# EAGLE design untitled (EAGLE 6.3)
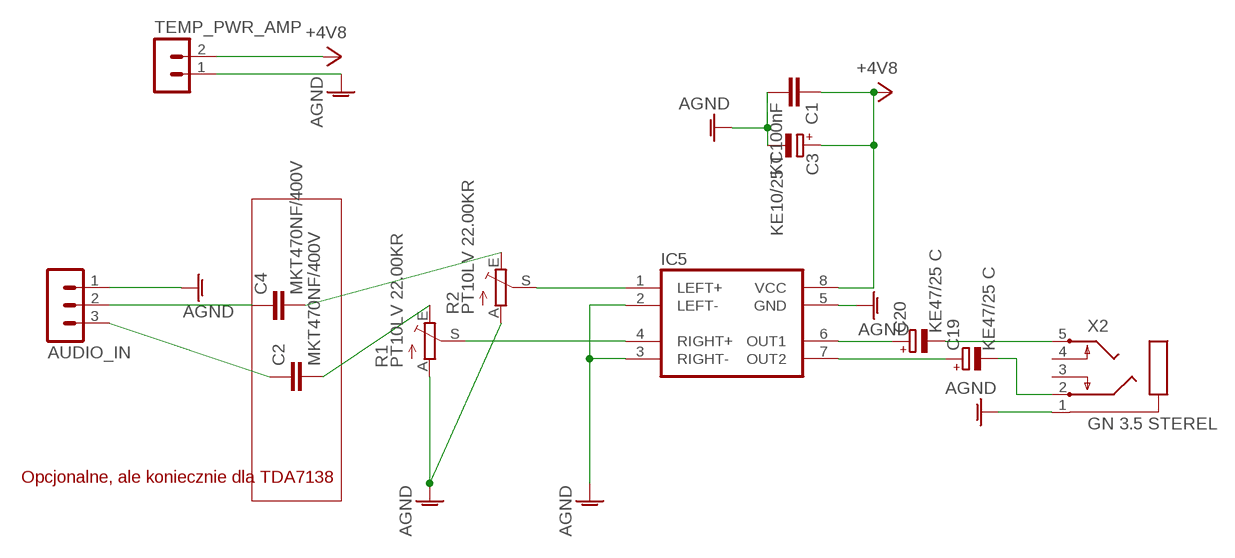
[diagram p0: schematic, sheet 1]

## Parts
AUDIO_IN  MA03-1  [MA03-1]
C1  KC100nF  C-EU025-025X050  [C025-025X050]
C2  MKT470NF/400V  C-EU150-091X182  [C150-091X182]
C3  KE10/25 T  CPOL-EUTT2D6  [TT2D6]
C4  MKT470NF/400V  C-EU150-091X182  [C150-091X182]
C19  KE47/25 C  CPOL-EUD  [PANASONIC_D]
C20  KE47/25 C  CPOL-EUD  [PANASONIC_D]
IC5  TDA7050  [DIL08]
R1  PT10LV 22.00KR  TRIM_EU-CA9V  [CA9V]
R2  PT10LV 22.00KR  TRIM_EU-CA9V  [CA9V]
TEMP_PWR_AMP  MA02-1  [MA02-1]
X2  GN 3.5 STEREL  STEREOJACK  [STX3100]

## Nets
+5V: C1.1 C3.+ IC5.8(VCC) TEMP_PWR_AMP.2 ; supply symbol labelled +4V8
AGND: AUDIO_IN.1 C1.2 C3.- IC5.2(LEFT-) IC5.3(RIGHT-) IC5.5(GND) R1.A R2.A TEMP_PWR_AMP.1 X2.1
N$1: AUDIO_IN.3 C2.1
N$2: AUDIO_IN.2 C4.1
N$7: IC5.1(LEFT+) R2.S
N$10: C2.2 R1.E
N$11: C4.2 R2.E
N$20: IC5.4(RIGHT+) R1.S
N$21: C19.+ IC5.7(OUT2)
N$22: C20.+ IC5.6(OUT1)
N$23: C19.- X2.2
N$24: C20.- X2.5
Unconnected: X2.3 X2.4

## Notes on the sheet
- Opcjonalne, ale koniecznie dla TDA7138

## Library data of the parts
AUDIO_IN = con-lstb:MA03-1: PIN HEADER; OC_FARNELL: unknown; OC_NEWARK: unknown
C1 C2 C4 = rcl:C-EU: CAPACITOR, European symbol
C3 C19 C20 = rcl:CPOL-EU: POLARIZED CAPACITOR, European symbol
IC5 = tda7050:TDA7050
R1 R2 = pot:TRIM_EU-: POTENTIOMETER
TEMP_PWR_AMP = con-lstb_SileliS:MA02-1: PIN HEADER
X2 = adafruit:STEREOJACK: MIC/HEADPHONE JACK Stereo jack with two switches. Kycon STX3100, CUI SJ1-3555NG and/or 4UCon 05544

## Board
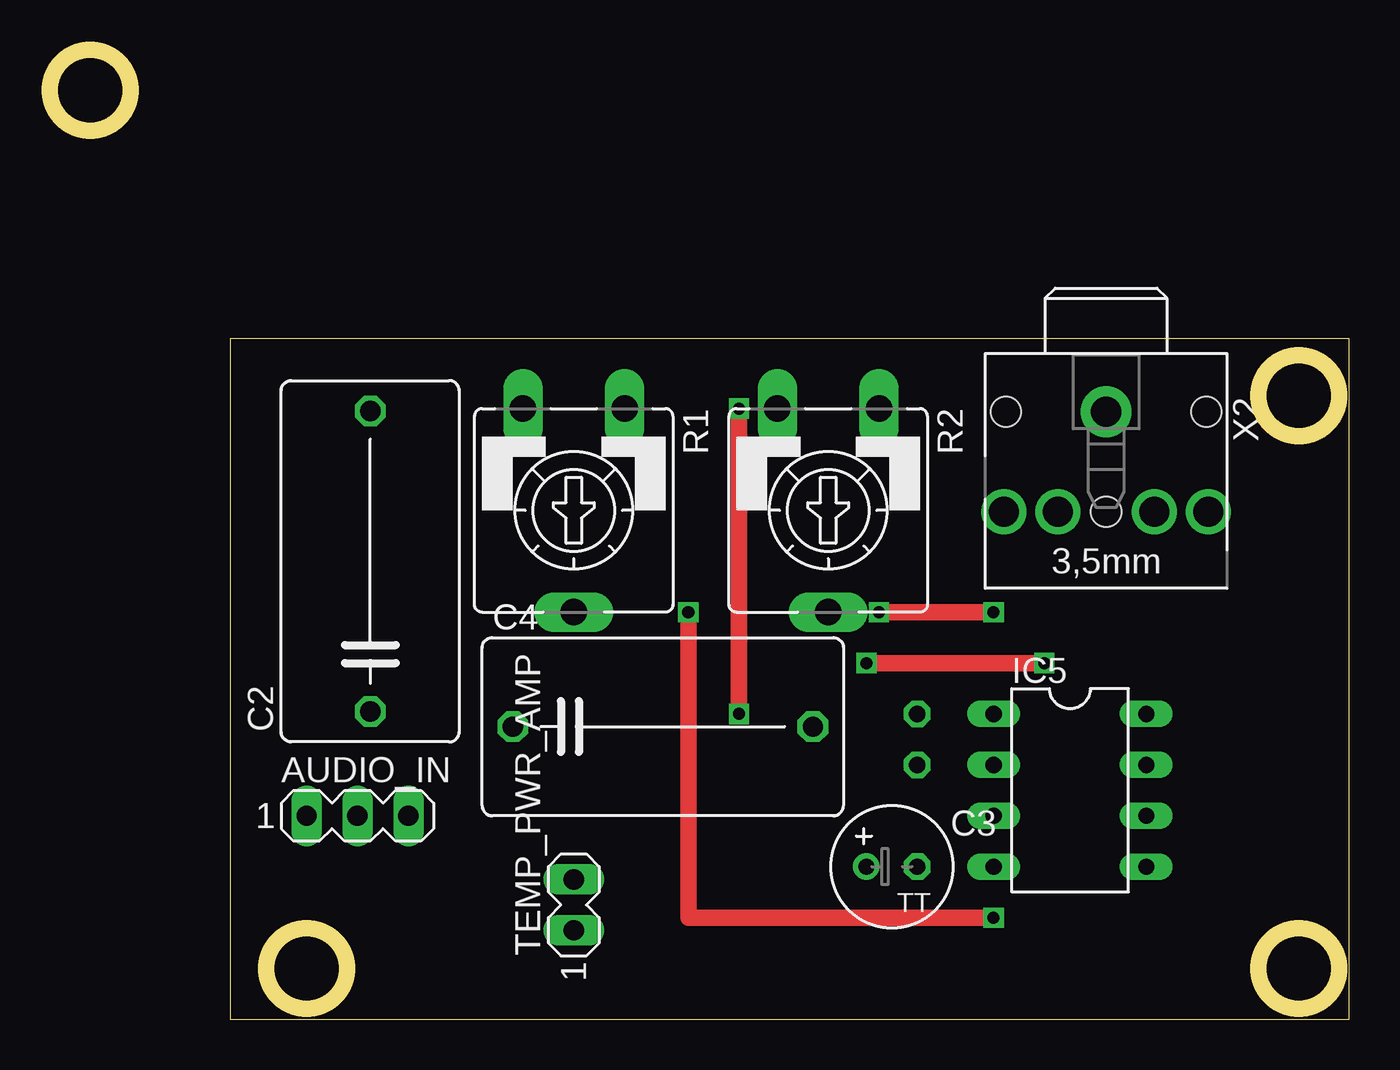
[diagram p1: board, top side]
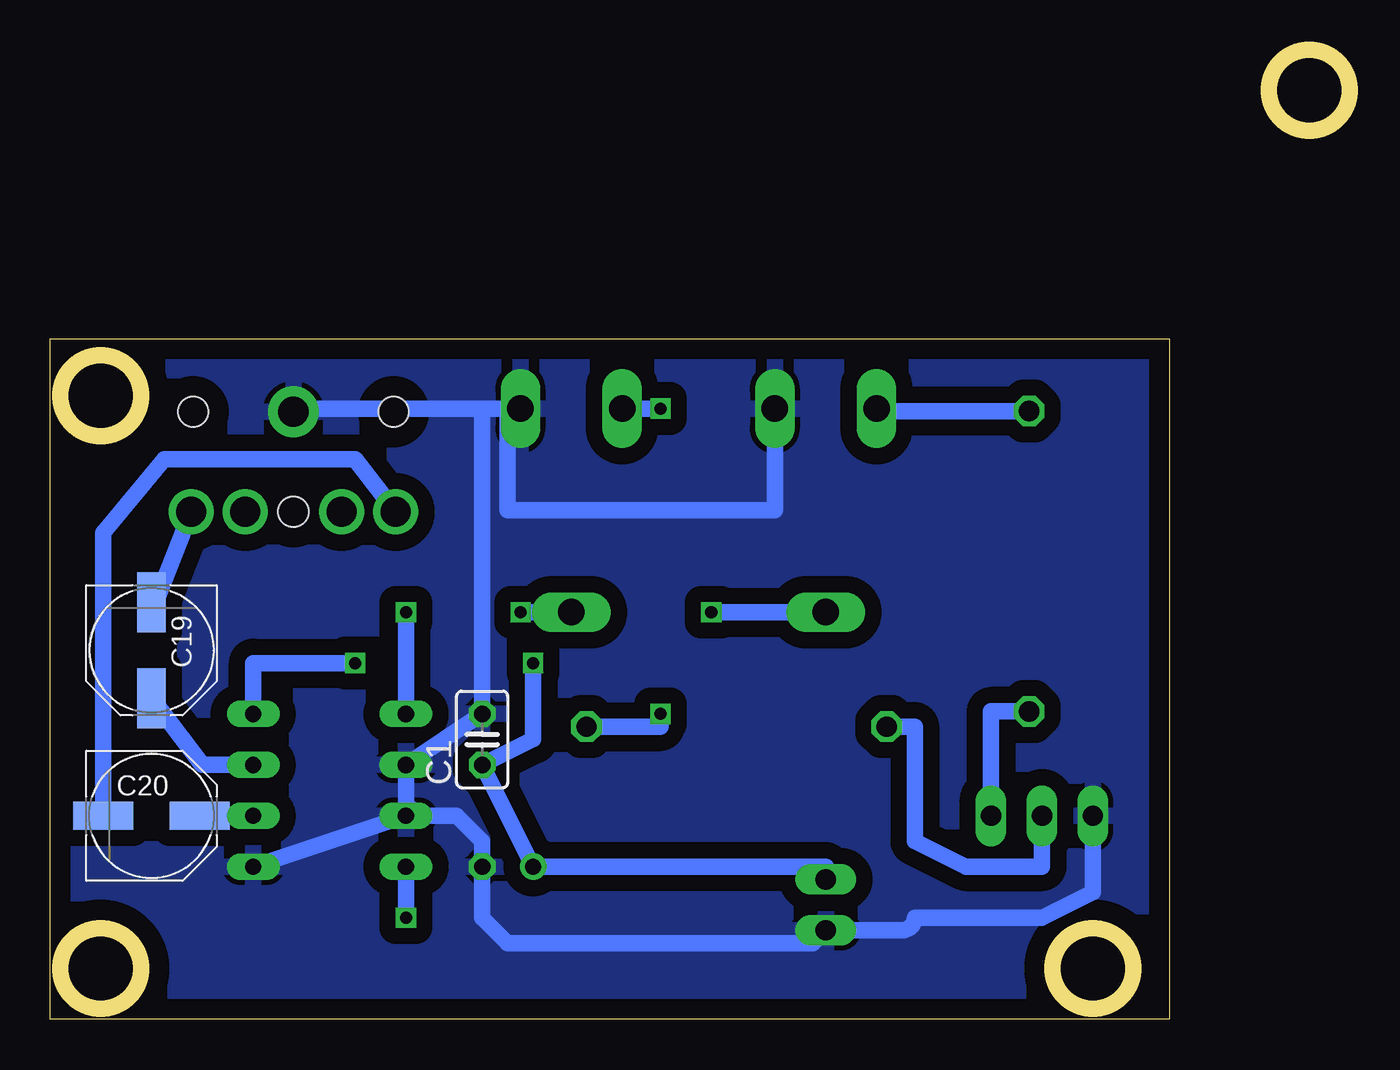
[diagram p2: board, bottom side, seen from below]

Size 64.85 x 48.36 mm. Coordinates in mm from the lower left corner, seen from the top.
Outline: 8.99,0 64.85,0 64.85,33.96 8.99,33.96 8.99,0
Outline: circle at 2.01,46.36 radius 2.01
Outline: circle at 62.33,31.11 radius 2.01
Outline: circle at 62.33,2.54 radius 2.01
Outline: circle at 12.8,2.54 radius 2.01
Copper layers (1*16): Top 0.035mm / dielectric 1.5mm / Bottom 0.035mm
Design rules "default": minimum track width 10mil, minimum drill 24mil, track to track 8mil, track to pad 8mil, pad to pad 8mil, via to via 8mil, smd to smd 8mil, copper to edge 40mil, drill to drill 8mil, minimum pad ring 10mil, minimum via ring 8mil, stop-mask expansion 4mil, vias tented up to drill 0mil, thermal gap 10mil

### Footprints (pad centres in the part's own frame; a part is rotated, then mirrored left to right if it is on the bottom)
MA03-1 = drill 1.016 long: 1 -2.54,0; 2 0,0; 3 2.54,0
C025-025X050 = drill 0.813 octagon: 1 -1.27,0; 2 1.27,0
C150-091X182 = drill 1.016 octagon: 1 -7.493,0; 2 7.493,0
TT2D6 = drill 0.813: + -1.27,0 | drill 0.813 octagon: - 1.27,0
PANASONIC_D = smd 3 x 1.4: + 2.4,0; - -2.4,0
DIL08 = drill 0.813 long: 1 -3.81,-3.81; 2 -1.27,-3.81; 3 1.27,-3.81; 4 3.81,-3.81; 5 3.81,3.81; 6 1.27,3.81; 7 -1.27,3.81; 8 -3.81,3.81
CA9V = drill 1.321 long: A -2.54,-5.08; E 2.54,-5.08; S 0,5.08
MA02-1 = drill 1.016 long: 1 -2.54,0; 2 0,0
STX3100 = drill 1.5 pad 2.54: 1 2.7,-0.1 | drill 1.5: 2 7.7,5; 3 7.7,2.3; 4 7.7,-2.5; 5 7.7,-5.2 | hole 1.5: 2.7,4.9; 2.7,-5.1; 7.7,-0.1

### Placement (x,y rotation side)
AUDIO_IN  15.34,10.16 0 top
C1  43.28,13.97 90 bottom
C2  15.98,22.86 90 top
C3  42.01,7.62 0 top
C4  30.58,14.61 0 top
C19  59.79,18.41 270 bottom
C20  59.79,10.16 0 bottom
IC5  50.9,11.43 270 top
R1  26.14,25.4 180 top
R2  38.84,25.4 180 top
TEMP_PWR_AMP  26.14,6.98 90 top
X2  52.81,33.02 270 top

### Tracks (layer width: path | path; a pad name or v marks a point on that pad's centre or on a via)
+5V  (via drill 0.6)
  Top 0.813: v49.63,17.78 v40.74,17.78
  Bottom 0.813: IC5.8 54.71,17.78 v49.63,17.78 | v40.74,17.78 40.74,13.97 C1.1 C3.+ 26.14,7.62 TEMP_PWR_AMP.2
AGND
  Bottom 0.813: IC5.3 46.77,10.48 | R2.A 42.01,30.48 | 42.01,30.48 43.28,30.48 | 43.28,30.48 52.55,30.48 arc-90 X2.1 | 43.28,30.48 C1.2 IC5.2 IC5.3 | AUDIO_IN.1 12.8,6.35 15.34,5.08 21.69,5.08 arc90 22.33,4.45 TEMP_PWR_AMP.1 26.77,3.81 42.01,3.81 43.28,5.08 C3.- 43.28,8.89 44.55,10.16 IC5.3 | IC5.3 IC5.5 | R1.A 28.68,25.4 42.01,25.4 42.01,30.48
  pour Bottom (isolate 0.813): 6.45,36.83 67.41,36.83 67.41,-2.54 6.45,-2.54
N$1
  Bottom 0.813: C2.1 17.88,15.37 AUDIO_IN.3
N$2
  Bottom 0.813: C4.1 21.69,14.61 21.69,8.89 19.15,7.62 15.34,7.62 AUDIO_IN.2
N$7  (via drill 0.6)
  Top 0.813: v47.09,20.32 v41.38,20.32
  Bottom 0.813: IC5.1 v47.09,20.32 | v41.38,20.32 R2.S
N$10
  Bottom 0.813: C2.2 23.6,30.35 R1.E
N$11  (via drill 0.6)
  Top 0.813: v34.39,15.24 v34.39,30.48
  Bottom 0.813: C4.2 34.39,14.61 v34.39,15.24 | v34.39,30.48 R2.E
N$20  (via drill 0.6)
  Top 0.813: v47.09,5.08 31.85,5.08 v31.85,20.32
  Bottom 0.813: IC5.4 v47.09,5.08 | v31.85,20.32 R1.S
N$21
  Bottom 0.813: IC5.7 57.25,12.7 C19.+
N$22
  Bottom 0.813: IC5.6 C20.+
N$23
  Bottom 0.813: X2.2 59.79,20.32 C19.-
N$24
  Bottom 0.813: X2.5 49.63,27.94 59.16,27.94 62.19,24.27 C20.-